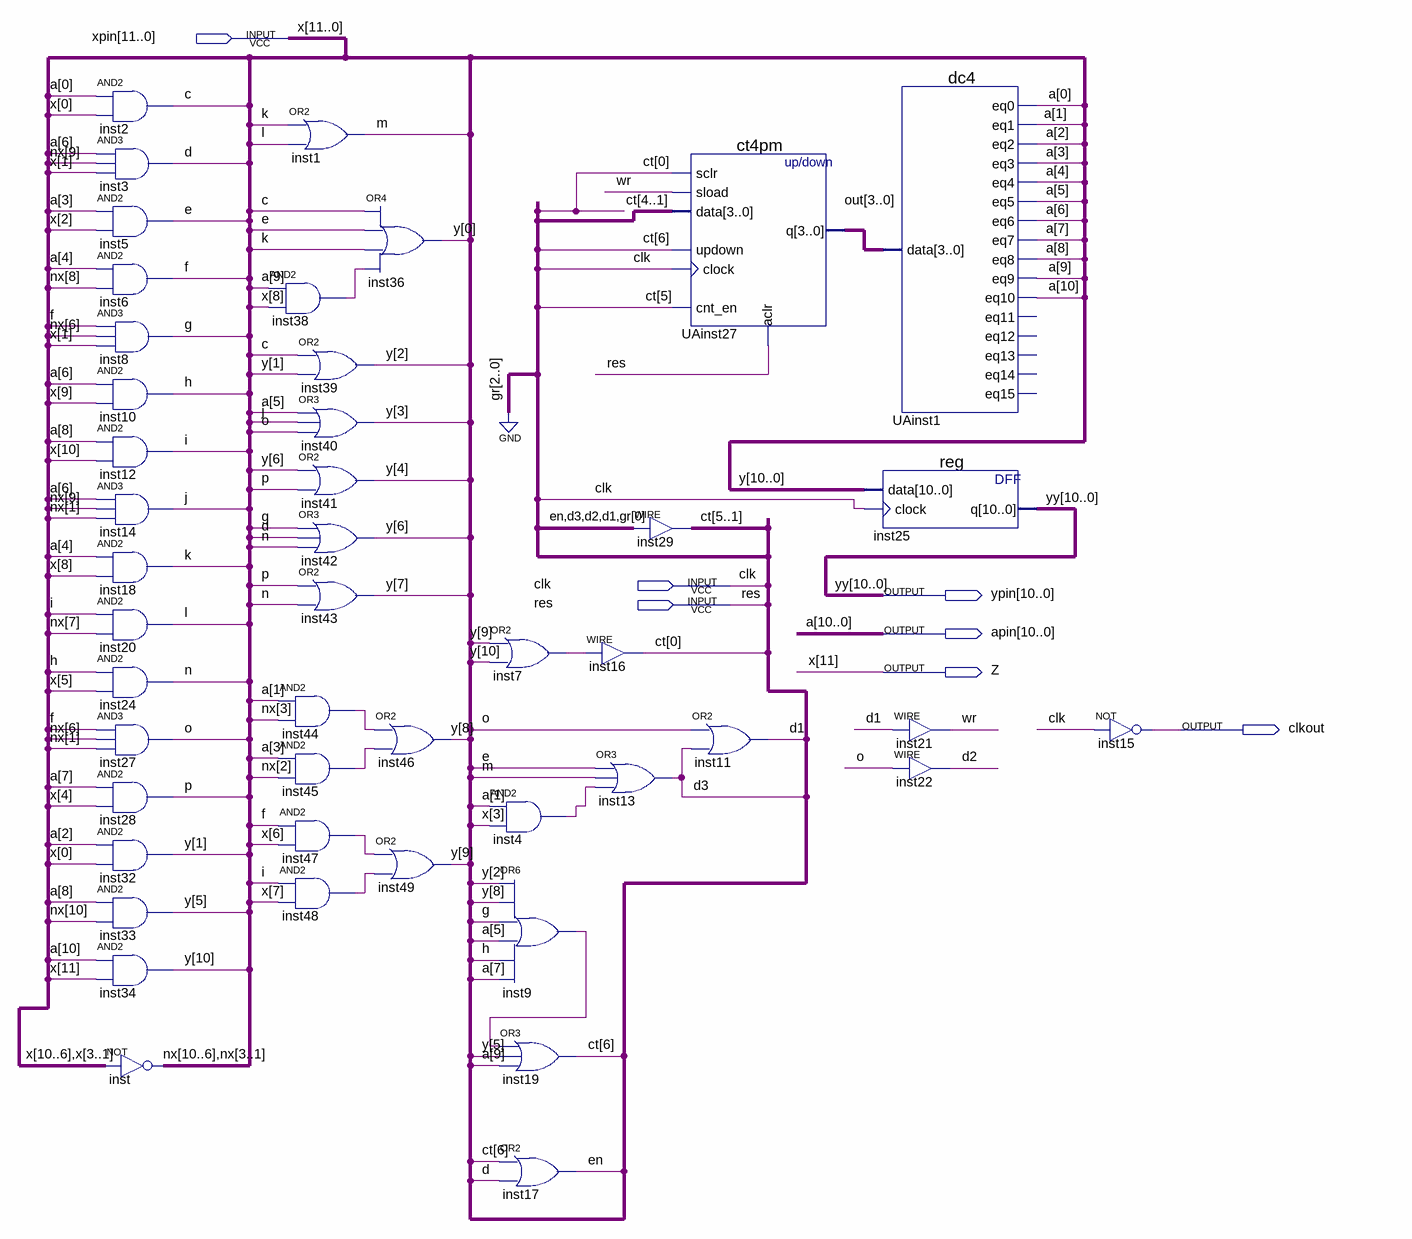
[diagram p0: schematic sheet]
// Quartus schematic UpAvt.bdf as structural Verilog: 46 symbols, 7 pins
module UpAvt (
  input  [11:0] xpin,
  input  clk,
  input  res,
  output [10:0] ypin,
  output [10:0] apin,
  output Z,
  output clkout
);

  wire c, d, d1, d2, d3, e, en, f, g, h, i, inst4_out, inst7_out, inst9_out, inst38_out, inst44_out,
       inst45_out, inst47_out, inst48_out, j, k, l, m, n, o, p, wr;
  wire [3:0] out;
  wire [6:0] ct;
  wire [10:0] y;
  wire [10:1] nx;

  and inst2 (c, apin[0], xpin[0]);
  and inst3 (d, apin[6], nx[9], xpin[1]);
  and inst5 (e, apin[3], xpin[2]);
  and inst6 (f, apin[4], nx[8]);
  and inst8 (g, f, nx[6], xpin[1]);
  and inst10 (h, apin[6], xpin[9]);
  and inst12 (i, apin[8], xpin[10]);
  and inst14 (j, apin[6], nx[9], nx[1]);
  and inst18 (k, apin[4], xpin[8]);
  and inst20 (l, i, nx[7]);
  and inst24 (n, h, xpin[5]);
  and inst27 (o, f, nx[6], nx[1]);
  and inst28 (p, apin[7], xpin[4]);
  and inst32 (y[1], apin[2], xpin[0]);
  and inst33 (y[5], apin[8], nx[10]);
  and inst34 (y[10], apin[10], xpin[11]);
  assign {nx[10:6], nx[3:1]} = ~{xpin[10:6], xpin[3:1]};  // NOT inst, 8 bits wide
  or inst1 (m, k, l);
  and inst38 (inst38_out, apin[9], xpin[8]);
  and inst44 (inst44_out, apin[1], nx[3]);
  and inst45 (inst45_out, apin[3], nx[2]);
  and inst47 (inst47_out, f, xpin[6]);
  and inst48 (inst48_out, i, xpin[7]);
  or inst36 (y[0], c, e, k, inst38_out);
  or inst39 (y[2], c, y[1]);
  or inst40 (y[3], apin[5], j, o);
  or inst41 (y[4], y[6], p);
  or inst42 (y[6], g, d, n);
  or inst43 (y[7], p, n);
  or inst46 (y[8], inst44_out, inst45_out);
  or inst49 (y[9], inst47_out, inst48_out);
  or inst7 (inst7_out, y[9], y[10]);
  and inst4 (inst4_out, apin[1], xpin[3]);
  or inst9 (inst9_out, y[2], y[8], g, apin[5], h, apin[7]);
  or inst19 (ct[6], inst9_out, y[5], apin[9]);
  or inst17 (en, ct[6], d);
  assign ct[0] = inst7_out;  // WIRE inst16
  or inst13 (d3, e, m, inst4_out);
  ct4pm UAinst27 (
    .sclr(ct[0]), .sload(wr), .data(ct[4:1]), .updown(ct[6]), .clock(clk), .cnt_en(ct[5]), .aclr(res), .q(out));
  assign ct[5:1] = {en, d3, d2, d1, 1'b0};  // WIRE inst29
  or inst11 (d1, o, d3);
  dc4 UAinst1 (
    .data(out), .eq0(apin[0]), .eq1(apin[1]), .eq2(apin[2]), .eq3(apin[3]), .eq4(apin[4]), .eq5(apin[5]),
    .eq6(apin[6]), .eq7(apin[7]), .eq8(apin[8]), .eq9(apin[9]), .eq10(apin[10]));  // open: eq11, eq12, eq13, eq14, eq15
  \reg  inst25 (.data(y), .clock(clk), .q(ypin));
  assign wr = d1;  // WIRE inst21
  assign d2 = o;  // WIRE inst22
  not inst15 (clkout, clk);

  assign Z = xpin[11];

  // Other names for the same wires on the sheet: a[10:0] = apin; x[11:0] = xpin; yy[10:0] = ypin
endmodule
